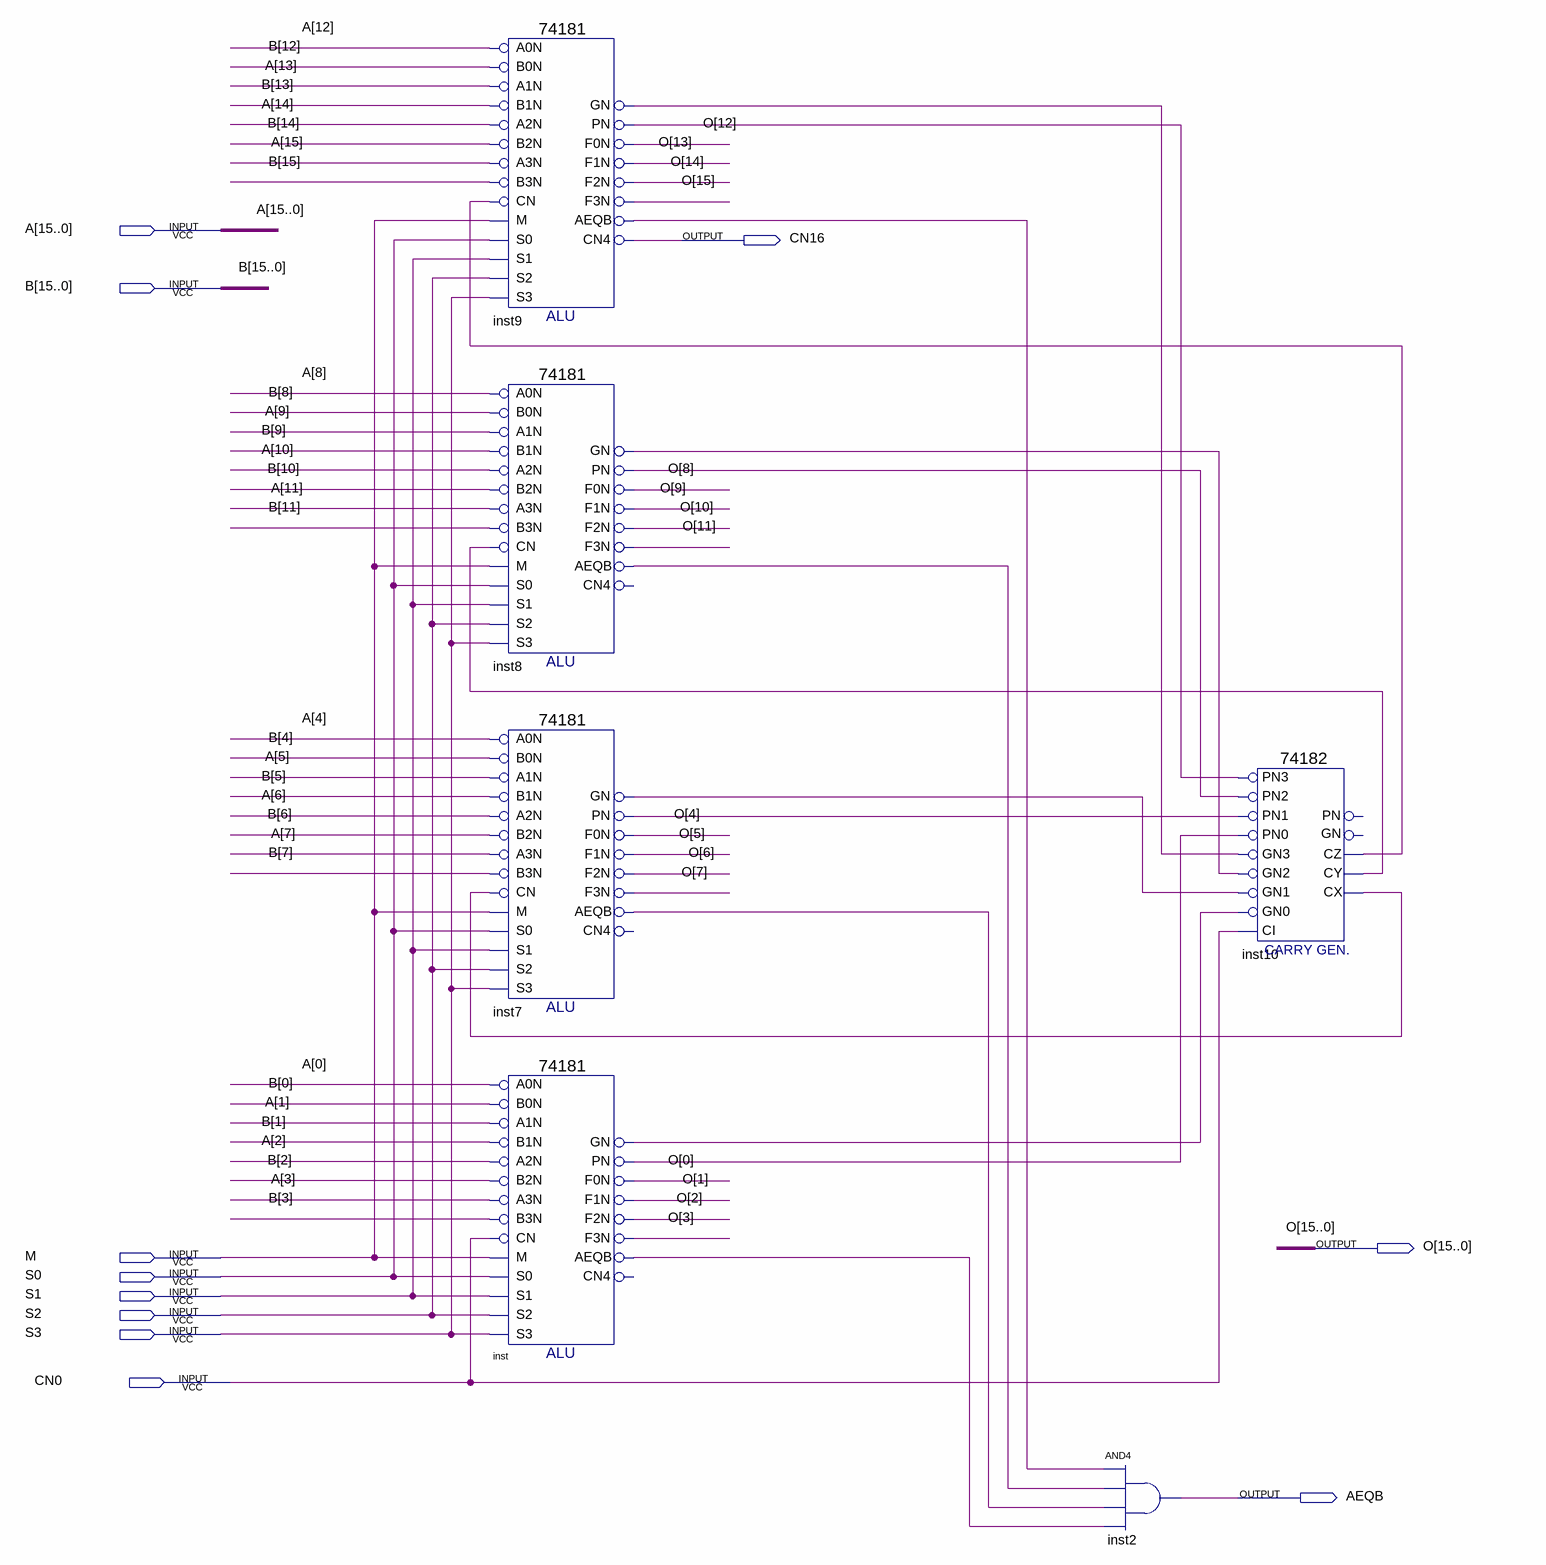
[diagram p0: schematic sheet]
// Quartus schematic ADD16.bdf as structural Verilog: 6 symbols, 11 pins
module ADD16 (
  input  [15:0] A,
  input  [15:0] B,
  input  M,
  input  S0,
  input  S1,
  input  S2,
  input  S3,
  input  CN0,
  output CN16,
  output [15:0] O,
  output AEQB
);

  wire inst7_aeqb, inst7_gn, inst7_pn, inst8_aeqb, inst8_gn, inst8_pn, inst9_aeqb, inst9_gn, inst9_pn,
       inst10_cx, inst10_cy, inst10_cz, inst_aeqb, inst_gn, inst_pn;

  \74181  inst9 (
    .B0N(B[12]), .A0N(A[12]), .A1N(A[13]), .B1N(B[13]), .A3N(A[15]), .B2N(B[14]), .A2N(A[14]), .M(M),
    .CN(inst10_cz), .B3N(B[15]), .S2(S2), .S1(S1), .S0(S0), .S3(S3), .PN(inst9_pn), .GN(inst9_gn),
    .F3N(O[15]), .F1N(O[13]), .F0N(O[12]), .AEQB(inst9_aeqb), .CN4(CN16), .F2N(O[14]));
  \74181  inst8 (
    .B0N(B[8]), .A0N(A[8]), .A1N(A[9]), .B1N(B[9]), .A3N(A[11]), .B2N(B[10]), .A2N(A[10]), .M(M),
    .CN(inst10_cy), .B3N(B[11]), .S2(S2), .S1(S1), .S0(S0), .S3(S3), .PN(inst8_pn), .GN(inst8_gn),
    .F3N(O[11]), .F1N(O[9]), .F0N(O[8]), .AEQB(inst8_aeqb), .F2N(O[10]));  // open: CN4
  \74181  inst7 (
    .B0N(B[4]), .A0N(A[4]), .A1N(A[5]), .B1N(B[5]), .A3N(A[7]), .B2N(B[6]), .A2N(A[6]), .M(M),
    .CN(inst10_cx), .B3N(B[7]), .S2(S2), .S1(S1), .S0(S0), .S3(S3), .PN(inst7_pn), .GN(inst7_gn), .F3N(O[7]),
    .F1N(O[5]), .F0N(O[4]), .AEQB(inst7_aeqb), .F2N(O[6]));  // open: CN4
  \74181  inst (
    .B0N(B[0]), .A0N(A[0]), .A1N(A[1]), .B1N(B[1]), .A3N(A[3]), .B2N(B[2]), .A2N(A[2]), .M(M), .CN(CN0),
    .B3N(B[3]), .S2(S2), .S1(S1), .S0(S0), .S3(S3), .PN(inst_pn), .GN(inst_gn), .F3N(O[3]), .F1N(O[1]),
    .F0N(O[0]), .AEQB(inst_aeqb), .F2N(O[2]));  // open: CN4
  and inst2 (AEQB, inst9_aeqb, inst8_aeqb, inst7_aeqb, inst_aeqb);
  \74182  inst10 (
    .PN2(inst8_pn), .GN2(inst8_gn), .GN3(inst9_gn), .PN3(inst9_pn), .CI(CN0), .PN1(inst7_pn), .PN0(inst_pn),
    .GN1(inst7_gn), .GN0(inst_gn), .CY(inst10_cy), .CX(inst10_cx), .CZ(inst10_cz));  // open: PN, GN
endmodule
